# EAGLE design ads1292_Dorokhov (EAGLE 7.1.0)
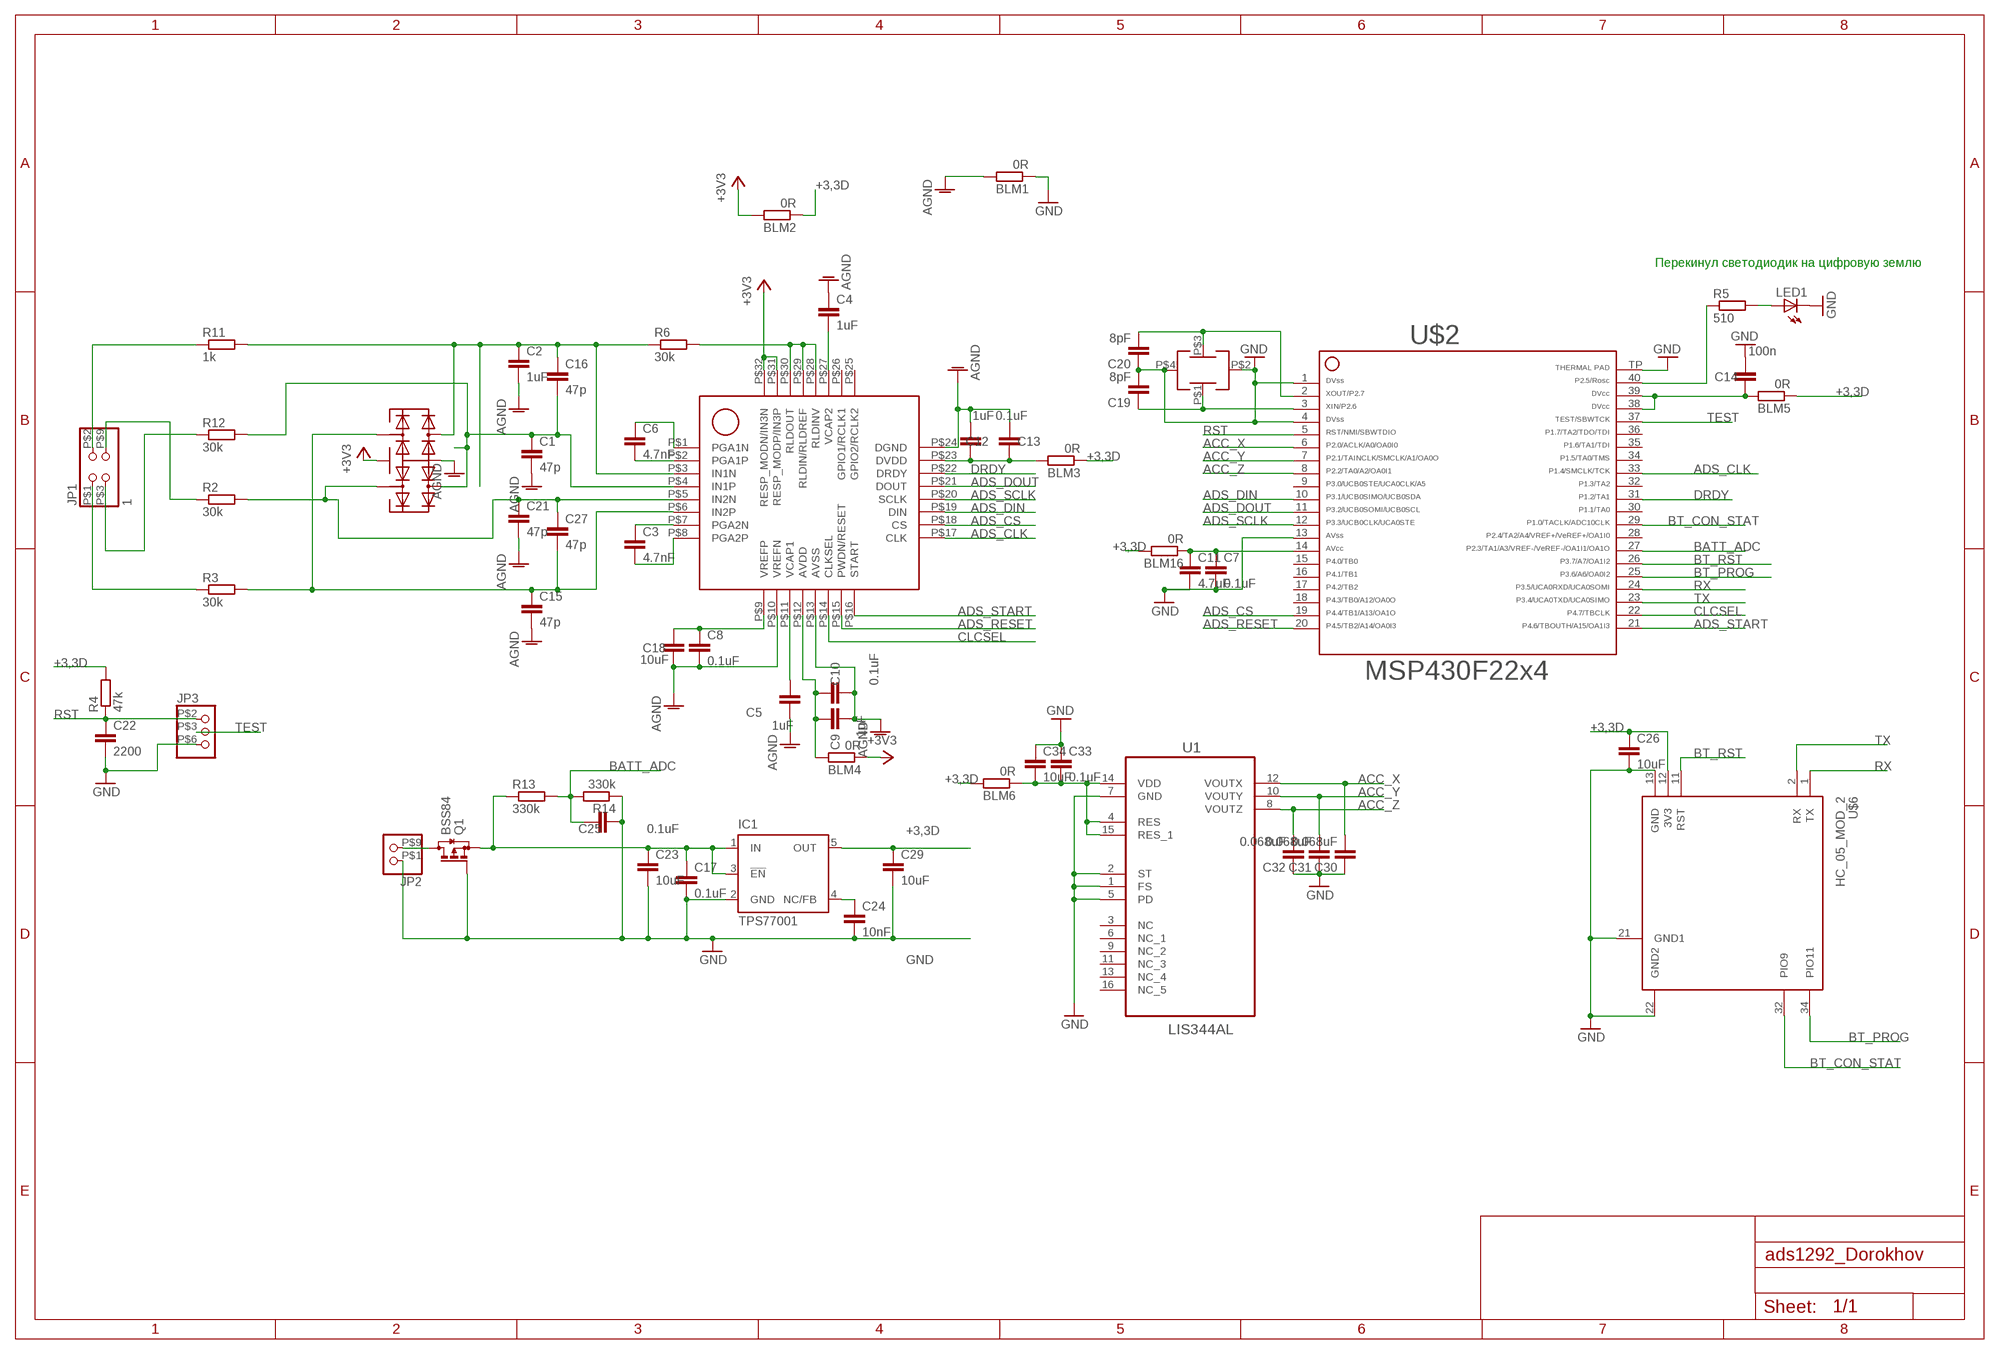
[diagram p0: schematic, sheet 1]

## Parts
BLM1  0R  RES0402  [SMD_0402]
BLM2  0R  RES0402  [SMD_0402]
BLM3  0R  RES0402  [SMD_0402]
BLM4  0R  RES0402  [SMD_0402]
BLM5  0R  RES0402  [SMD_0402]
BLM6  0R  RES0402  [SMD_0402]
BLM16  0R  RES0402  [SMD_0402]
C1  47p  CAP0402  [SMD_0402]
C2  1uF  CAP0603  [SMD_0603]
C3  4.7nF  CAP0402  [SMD_0402]
C4  1uF  CAP0402  [SMD_0402]
C5  1uF  CAP0402  [SMD_0402]
C6  4.7nF  CAP0402  [SMD_0402]
C7  0.1uF  CAP0402  [SMD_0402]
C8  0.1uF  CAP0402  [SMD_0402]
C9  1uF  CAP0402  [SMD_0402]
C10  0.1uF  CAP0402  [SMD_0402]
C11  4.7uF  CAP0603  [SMD_0603]
C12  1uF  CAP0402  [SMD_0402]
C13  0.1uF  CAP0402  [SMD_0402]
C14  100n  CAP0402  [SMD_0402]
C15  47p  CAP0402  [SMD_0402]
C16  47p  CAP0402  [SMD_0402]
C17  0.1uF  CAP0402  [SMD_0402]
C18  10uF  CAP0603  [SMD_0603]
C19  8pF  CAP0402  [SMD_0402]
C20  8pF  CAP0402  [SMD_0402]
C21  47p  CAP0402  [SMD_0402]
C22  2200  CAP0402  [SMD_0402]
C23  10uF  CAP0603  [SMD_0603]
C24  10nF  CAP0402  [SMD_0402]
C25  0.1uF  CAP0402  [SMD_0402]
C26  10uF  CAP0603  [SMD_0603]
C27  47p  CAP0402  [SMD_0402]
C29  10uF  CAP0603  [SMD_0603]
C30  0.068uF  CAP0402  [SMD_0402]
C31  0.068uF  CAP0402  [SMD_0402]
C32  0.068uF  CAP0402  [SMD_0402]
C33  0.1uF  CAP0402  [SMD_0402]
C34  10uF  CAP0603  [SMD_0603]
IC1  TPS77001  [SOT23-DBV]
JP1  1  PINHD-2X2SMD_2,5  [PINHEAD_SMD_2X2_2,5]
JP2  PINHD-1X2SMD_2,5  [PINHEAD_SMD_2X1_2,5]
JP3  PINHD-1X3PROG_SMD  [PROG_CONNECTOR_3PIN]
LED1  LEDSML0603  [SML0603]
Q1  BSS84  [SOT23]
R2  30k  RESR0603_WIDE  [R0603]
R3  30k  RESR0603_WIDE  [R0603]
R4  47k  RES0402  [SMD_0402]
R5  510  RES0402  [SMD_0402]
R6  30k  RES0402  [SMD_0402]
R11  1k  RESR0603_WIDE  [R0603]
R12  30k  RESR0603_WIDE  [R0603]
R13  330k  RES0402  [SMD_0402]
R14  330k  RES0402  [SMD_0402]
U1  LIS344AL  [LGA16R65P4X4_400X400X160]
U$1  ADS1292TQFP-32  [TQFP-32]
U$2  F22X4---RHA40  [RHA40]
U$3  ECS_16_CRYSTAL  [ECS_16_CRYSTAL]
U$4  DALC208  [SOT23-6]
U$6  HC_05_MOD_2  [BLUETOOTH_SMD_MOD2]

## Nets
+3,3D: BLM2.P$3 BLM3.P$3 BLM5.P$3 BLM6.P$4 BLM16.P$4 C26.P$1 C29.P$1 IC1.5(OUT) R4.P$4 U$6.12(3V3)
+3V3: BLM2.P$4 BLM4.P$3 U$1.P$31(RESP_MODP/IN3P) U$1.P$32(RESP_MODN/IN3N) U$4.2
ACC_X: C30.P$4 U1.12(VOUTX) U$2.6
ACC_Y: C31.P$4 U1.10(VOUTY) U$2.7
ACC_Z: C32.P$4 U1.8(VOUTZ) U$2.8
ADS_CLK: U$1.P$17(CLK) U$2.33
ADS_CS: U$1.P$18(CS) U$2.19
ADS_DIN: U$1.P$19(DIN) U$2.10
ADS_DOUT: U$1.P$21(DOUT) U$2.11
ADS_RESET: U$1.P$15(PWDN/RESET) U$2.20
ADS_SCLK: U$1.P$20(SCLK) U$2.12
ADS_START: U$1.P$16(START) U$2.21
AGND: BLM1.P$4 C1.P$4 C2.P$2 C4.P$3 C5.P$4 C8.P$4 C9.P$4 C10.P$4 C12.P$4 C13.P$4 C15.P$4 C18.P$2 C21.P$4 U$1.P$10(VREFN) U$1.P$13(AVSS) U$1.P$24(DGND) U$4.5
BATT_ADC: C25.P$3 R13.P$4 R14.P$4 U$2.27
BT_CON_STAT: U$2.29 U$6.32(PIO9)
BT_PROG: U$2.25 U$6.34(PIO11)
BT_RST: U$2.26 U$6.11(RST)
CLCSEL: U$1.P$14(CLKSEL) U$2.22
DRDY: U$1.P$22(DRDY) U$2.31
GND: BLM1.P$3 C7.P$4 C11.P$2 C14.P$4 C17.P$4 C19.P$4 C20.P$3 C22.P$4 C23.P$2 C24.P$4 C25.P$4 C26.P$2 C29.P$2 C30.P$3 C31.P$3 C32.P$3 C33.P$3 C34.P$1 IC1.2(GND) JP2.P$1 JP3.P$6 LED1.C Q1.1(G) R14.P$3 U1.1(FS) U1.2(ST) U1.5(PD) U1.7(GND) U$2.1 U$2.4 U$2.13 U$2.TP U$3.P$2 U$3.P$4 U$6.13(GND) U$6.21(GND1) U$6.22(GND2)
N$1: BLM3.P$4 C12.P$3 C13.P$3 U$1.P$23(DVDD)
N$2: BLM16.P$3 C7.P$3 C11.P$1 U$2.14
N$3: BLM4.P$4 C9.P$3 C10.P$3 U$1.P$12(AVDD)
N$4: C21.P$3 C27.P$3 R2.2 U$1.P$5(IN2N) U$4.3
N$5: C3.P$3 U$1.P$7(PGA2N)
N$6: C3.P$4 U$1.P$8(PGA2P)
N$7: C5.P$3 U$1.P$11(VCAP1)
N$8: C4.P$4 U$1.P$27(VCAP2)
N$9: C6.P$4 U$1.P$2(PGA1P)
N$10: C6.P$3 U$1.P$1(PGA1N)
N$11: C8.P$3 C18.P$1 U$1.P$9(VREFP)
N$12: BLM5.P$4 C14.P$3 U$2.38 U$2.39
N$13: R5.P$3 U$2.40
N$14: C15.P$3 C27.P$4 R3.2 U$1.P$6(IN2P) U$4.1
N$15: C1.P$3 C16.P$4 R12.2 U$1.P$4(IN1P) U$4.6
N$16: C19.P$3 U$2.3 U$3.P$1
N$17: BLM6.P$3 C33.P$4 C34.P$2 U1.4(RES) U1.14(VDD) U1.15(RES_1)
N$19: LED1.A R5.P$4
N$20: JP1.P$1 R3.1
N$21: JP1.P$9 R2.1
N$22: JP1.P$3 R12.1
N$23: C2.P$1 C16.P$3 R6.P$3 R11.2 U$1.P$3(IN1N) U$4.4
N$24: JP1.P$2 R11.1
N$25: C20.P$4 U$2.2 U$3.P$3
N$26: JP2.P$9 Q1.3(D)
N$27: R6.P$4 U$1.P$28(RLDINV) U$1.P$29(RLDIN/RLDREF) U$1.P$30(RLDOUT)
N$30: C24.P$3 IC1.4(NC/FB)
RST: C22.P$3 JP3.P$2 R4.P$3 U$2.5
RX: U$2.24 U$6.1(TX)
TEST: JP3.P$3 U$2.37
TX: U$2.23 U$6.2(RX)
VLOAD: C17.P$3 C23.P$1 IC1.1(IN) IC1.3(!EN) Q1.2(S) R13.P$3
Unconnected: U1.3(NC) U1.6(NC_1) U1.9(NC_2) U1.11(NC_3) U1.13(NC_4) U1.16(NC_5) U$1.P$25(GPIO2/RCLK2) U$1.P$26(GPIO1/RCLK1) U$2.9 U$2.15 U$2.16 U$2.17 U$2.18 U$2.28 U$2.30 U$2.32 U$2.34 U$2.35 U$2.36

## Notes on the sheet
- Перекинул светодиодик на цифровую землю

## Library data of the parts
BLM1-BLM6 BLM16 R2-R6 R11-R14 = ads1292_Dorokhov:RES
C1-C27 C29-C34 = ads1292_Dorokhov:CAP: Capacitor Standard 0603 ceramic capacitor, and 0.1" leaded capacitor.
IC1 = texas:TPS770*: ULTRALOW-POWER 50-mA LOW-DROPOUT LINEAR REGULATORS 50-mA Low-Dropout Regulator Source: http://focus.ti.com/lit/ds/symlink/tps77001.pdf; MF: TEXAS INSTRUMENTS; MPN: TPS77001DBVT; OC_FARNELL: 8461554; OC_NEWARK: 77C1171
JP1 = ads1292_Dorokhov:PINHD-2X2: PIN HEADER
JP2 = ads1292_Dorokhov:PINHD-1X2: PIN HEADER
JP3 = ads1292_Dorokhov:PINHD-1X3: PIN HEADER
LED1 = led:LED: LED OSRAM: - CHIPLED LG R971, LG N971, LY N971, LG Q971, LY Q971, LO R971, LY R971 LH N974, LH R974 LS Q976, LO Q976, LY Q976 LO Q996 - Hyper CHIPLED LW Q18S LB Q993, LB Q99A, LB R99A - SideLED LS A670, LO A670, LY A670, LG A670, LP A670 LB A673, LV A673, LT A673, LW A673 LH A674 LY A675 LS A676, LA A676, LO A676, LY A676, LW A676 LS A679, LY A679, LG A679 - Hyper Micro SIDELED® LS Y876, LA Y876, LO Y876, LY Y876 LT Y87S - SmartLED LW L88C, LW L88S LB L89C, LB L89S, LG L890 LS L89K, LO L89K, LY L89K LS L896, LA L896, LO L896, LY L896 - TOPLED LS T670, LO T670, LY T670, LG T670, LP T670 LSG T670, LSP T670, LSY T670, LOP T670, LYG T670 LG T671, LOG T671, LSG T671 LB T673, LV T673, LT T673, LW T673 LH T674 LS T676, LA T676, LO T676, LY T676, LB T676, LH T676, LSB T676, LW T676 LB T67C, LV T67C, LT T67C, LS T67K, LO T67K, LY T67K, LW E67C LS E67B, LA E67B, LO E67B, LY E67B, LB E67C, LV E67C, LT E67C LW T67C LS T679, LY T679, LG T679 LS T770, LO T770, LY T770, LG T770, LP T770 LB T773, LV T773, LT T773, LW T773 LH T774 LS E675, LA E675, LY E675, LS T675 LS T776, LA T776, LO T776, LY T776, LB T776 LHGB T686 LT T68C, LB T68C - Hyper Mini TOPLED® LB M676 - Mini TOPLED Santana® LG M470 LS M47K, LO M47K, LY M47K Source: http://www.osram.convergy.de LUXEON: - LUMILED® LXK2-PW12-R00, LXK2-PW12-S00, LXK2-PW14-U00, LXK2-PW14-V00 LXK2-PM12-R00, LXK2-PM12-S00, LXK2-PM14-U00 LXK2-PE12-Q00, LXK2-PE12-R00, LXK2-PE12-S00, LXK2-PE14-T00, LXK2-PE14-U00 LXK2-PB12-K00, LXK2-PB12-L00, LXK2-PB12-M00, LXK2-PB14-N00, LXK2-PB14-P00, LXK2-PB14-Q00 LXK2-PR12-L00, LXK2-PR12-M00, LXK2-PR14-Q00, LXK2-PR14-R00 LXK2-PD12-Q00, LXK2-PD12-R00, LXK2-PD12-S00 LXK2-PH12-R00, LXK2-PH12-S00 LXK2-PL12-P00, LXK2-PL12-Q00, LXK2-PL12-R00 Source: www.luxeon.com KINGBRIGHT: KA-3528ASYC Source: www.kingbright.com
Q1 = transistor-small-signal:BSS84: P-CHANNEL MOS FET
U1 = ads1292_Dorokhov:LIS344AL: MEMS inertial sensor; MPN: LIS344AL; OC_FARNELL: 1838529; OC_NEWARK: 56P7991; PACKAGE: LGA-16; SUPPLIER: STMicroelectronics
U$1 = ads1292_Dorokhov:ADS1292
U$2 = TI_MSP430_v16:F22X4---RHA40: ***MSP430F22x4***RHA40
U$3 = alvw:ECS_16_CRYSTAL
U$4 = ads1292_Dorokhov:DALC208
U$6 = ads1292_Dorokhov:HC_05_MOD_2

## Board
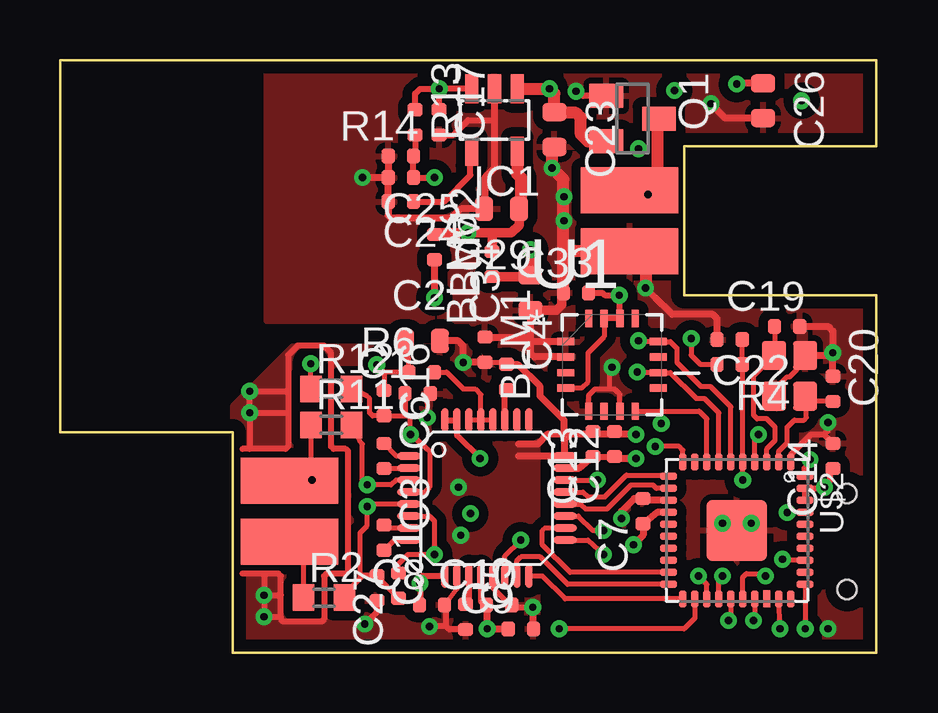
[diagram p1: board, top side]
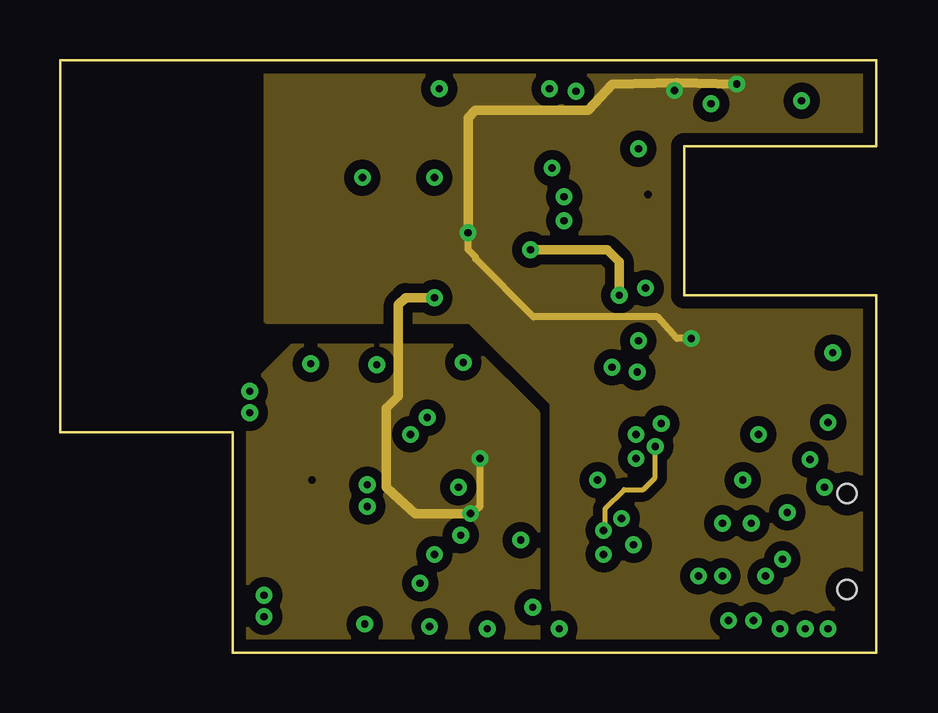
[diagram p2: board, inner layer POWER]
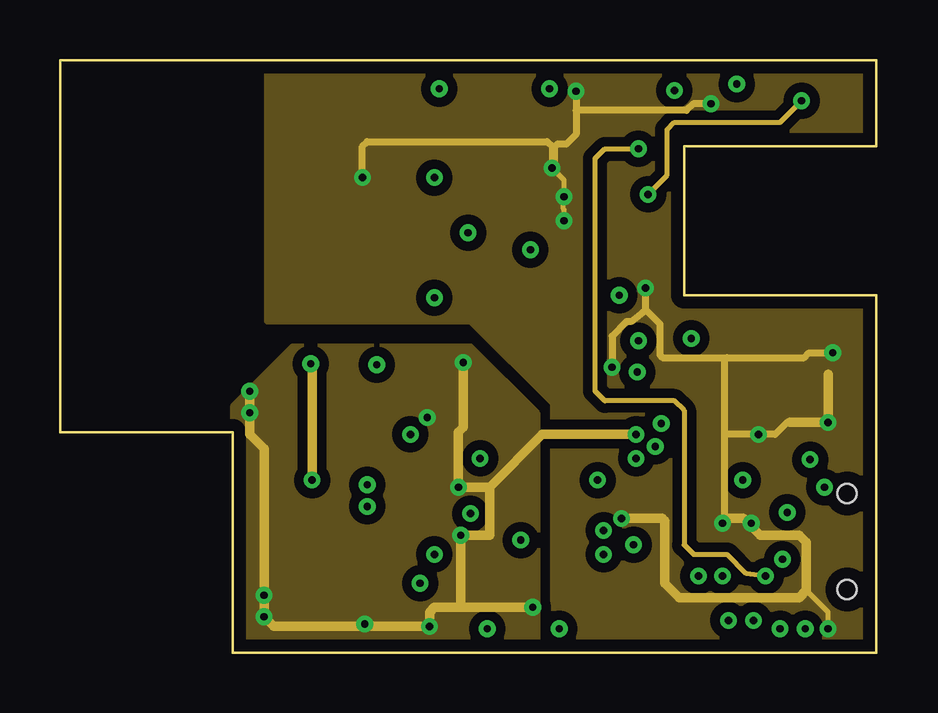
[diagram p3: board, inner layer GND]
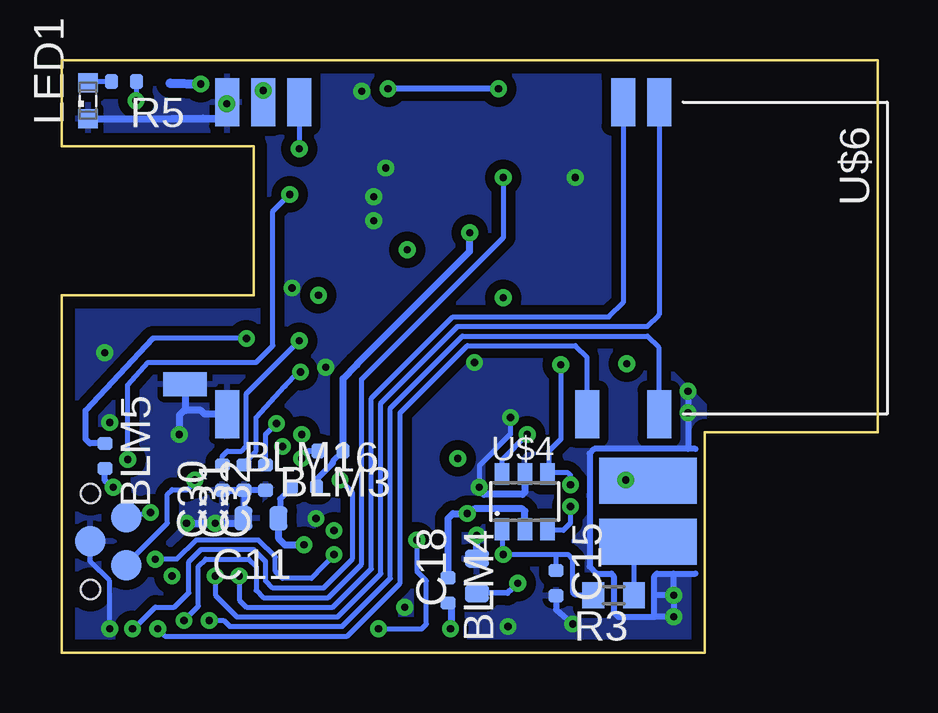
[diagram p4: board, bottom side, seen from below]

Size 34 x 24.7 mm. Coordinates in mm from the lower left corner, seen from the top.
Outline: 7.2,0 34,0 34,14.9 26,14.9 26,21.1 34,21.1 34,24.7 0,24.7 0,9.2 7.2,9.2 7.2,0
Copper layers ((1*2)+(15*16)): Top 0.018mm / dielectric 0.5mm / POWER 0.018mm / dielectric 0.5mm / GND 0.018mm / dielectric 0.5mm / Bottom 0.018mm
Design rules "default *": minimum track width 0.15mm, minimum drill 0.3mm, track to track 0.2mm, track to pad 0.2mm, pad to pad 0.2mm, via to via 0.2mm, smd to smd 0mil, copper to edge 0.5mm, drill to drill 8mil, minimum pad ring 10mil, minimum via ring 0.2mm, stop-mask expansion 4mil, vias tented up to drill 0mil, thermal gap 10mil

### Footprints (pad centres in the part's own frame; a part is rotated, then mirrored left to right if it is on the bottom)
SMD_0402 = smd 0.55 x 0.625: P$3 -0.525,0; P$4 0.525,0
SMD_0603 = smd 0.75 x 1: P$1 -0.725,0; P$2 0.725,0
SOT23-DBV = smd 0.55 x 1.2: 1 -0.95,-1.3; 2 0,-1.3; 3 0.95,-1.3; 4 0.95,1.3; 5 -0.95,1.3
PINHEAD_SMD_2X2_2,5 = smd 4.064 x 1.905 bottom: P$1 1.27,-1.27; P$3 1.27,1.27 | smd 4.064 x 1.905: P$2 1.27,1.27; P$9 1.27,-1.27
PINHEAD_SMD_2X1_2,5 = smd 4.064 x 1.905: P$1 1.27,1.27; P$9 1.27,-1.27
PROG_CONNECTOR_3PIN = smd 1.27 x 1.27: P$2 -1,-0.5; P$3 1,-0.5; P$6 0,1 | hole 0.8: -2,1; 2,1
SML0603 = smd 0.8 x 0.8: A 0.75,0; C -0.75,0
SOT23 = smd 1 x 1.4: 1 -0.95,-1.1; 2 0.95,-1.1; 3 0,1.1
R0603 = smd 0.9 x 1.1: 1 -0.85,0; 2 0.85,0
LGA16R65P4X4_400X400X160 = smd 0.711 x 0.305: 1 -1.93,0.965; 2 -1.93,0.33; 3 -1.93,-0.33; 4 -1.93,-0.965; 9 1.93,-0.965; 10 1.93,-0.33; 11 1.93,0.33; 12 1.93,0.965 | smd 0.305 x 0.711: 5 -0.965,-1.93; 6 -0.33,-1.93; 7 0.33,-1.93; 8 0.965,-1.93; 13 0.965,1.93; 14 0.33,1.93; 15 -0.33,1.93; 16 -0.965,1.93
TQFP-32 = smd 1 x 0.29: P$1 -3.16,2.5; P$2 -3.16,2; P$3 -3.16,1.5; P$4 -3.16,1; P$5 -3.16,0.5; P$6 -3.16,0; P$7 -3.16,-0.5; P$8 -3.16,-1; P$17 3.34,-1; P$18 3.34,-0.5; P$19 3.34,0; P$20 3.34,0.5; P$21 3.34,1; P$22 3.34,1.5; P$23 3.34,2; P$24 3.34,2.5 | smd 0.29 x 1: P$9 -1.66,-2.5; P$10 -1.16,-2.5; P$11 -0.66,-2.5; P$12 -0.16,-2.5; P$13 0.34,-2.5; P$14 0.84,-2.5; P$15 1.34,-2.5; P$16 1.84,-2.5; P$25 1.84,4; P$26 1.34,4; P$27 0.84,4; P$28 0.34,4; P$29 -0.16,4; P$30 -0.66,4; P$31 -1.16,4; P$32 -1.66,4
RHA40 = smd 0.7 x 0.3: 1 -2.85,2.25; 2 -2.85,1.75; 3 -2.85,1.25; 4 -2.85,0.75; 5 -2.85,0.25; 6 -2.85,-0.25; 7 -2.85,-0.75; 8 -2.85,-1.25; 9 -2.85,-1.75; 10 -2.85,-2.25; 21 2.85,-2.25; 22 2.85,-1.75; 23 2.85,-1.25; 24 2.85,-0.75; 25 2.85,-0.25; 26 2.85,0.25; 27 2.85,0.75; 28 2.85,1.25; 29 2.85,1.75; 30 2.85,2.25 | smd 0.3 x 0.7: 11 -2.25,-2.85; 12 -1.75,-2.85; 13 -1.25,-2.85; 14 -0.75,-2.85; 15 -0.25,-2.85; 16 0.25,-2.85; 17 0.75,-2.85; 18 1.25,-2.85; 19 1.75,-2.85; 20 2.25,-2.85; 31 2.25,2.85; 32 1.75,2.85; 33 1.25,2.85; 34 0.75,2.85; 35 0.25,2.85; 36 -0.25,2.85; 37 -0.75,2.85; 38 -1.25,2.85; 39 -1.75,2.85; 40 -2.25,2.85 | smd 2.54 x 2.54: TP 0,0
ECS_16_CRYSTAL = smd 1.2 x 1: P$1 -0.85,-0.65; P$2 -0.85,0.65; P$3 0.85,0.65; P$4 0.85,-0.65
SOT23-6 = smd 0.6 x 0.9: 1 -0.95,-1.15; 2 0,-1.15; 3 0.95,-1.15; 4 0.95,1.15; 5 0,1.15; 6 -0.95,1.15
BLUETOOTH_SMD_MOD2 = smd 2 x 1: 1 -6.35,6.35; 2 -6.35,4.85; 11 -6.35,-8.65; 12 -6.35,-10.15; 13 -6.35,-11.65; 22 6.65,-11.65; 32 6.65,3.35; 34 6.65,6.35 | smd 1 x 1.8: 21 5.4,-13.4

### Placement (x,y rotation side)
BLM1  17.7,12.63 270 top
BLM2  15.6,16.9 270 top
BLM3  22.8,8.4 180 bottom
BLM4  17.9,2.6 270 bottom
BLM5  32.2,8.2 270 bottom
BLM6  18,16.2 90 top
BLM16  23.9,6.9 0 bottom
C1  14.9,10.8 0 top
C2  15.1,13 0 top
C3  13.5,4.8 270 top
C4  18.6,11.5 270 top
C5  16.9,1.5 270 top
C6  13.5,8.2 270 top
C7  24.3,5.9 90 top
C8  15.5,2 0 top
C9  19.2,1 0 top
C10  18.3,2 0 top
C11  25.7,5.6 180 bottom
C12  23.1,8.7 90 top
C13  22.2,8.7 90 top
C14  32.2,8.2 90 top
C15  13.4,2.9 270 bottom
C16  13.5,10.4 270 top
C17  15.8,22.1 270 top
C18  16.7,3.2 90 bottom
C19  30.3,13.6 0 top
C20  32.2,11 270 top
C21  13.2,2.7 270 top
C22  27.9,13.05 180 top
C23  20.6,21.8 270 top
C24  14.2,18.8 180 top
C25  14.2,19.8 180 top
C26  29.3,23 270 top
C27  14.1,2.8 90 top
C29  18.4,18.5 180 top
C30  27.3,7.3 90 bottom
C31  26.4,7.3 90 bottom
C32  25.5,7.3 90 bottom
C33  21.5,15 0 top
C34  19.6,15 90 top
IC1  18.1,22.2 180 top
JP1  8.3,5.9 0 top
JP2  25,18 180 top
JP3  31.8,4.64 90 bottom
LED1  32.9,23 90 bottom
Q1  23.86,22.26 270 top
R2  11,2.3 0 top
R3  11,2.4 180 bottom
R4  27.9,12.01 180 top
R5  31.4,23.8 180 bottom
R6  15.07,11.69 0 top
R11  11.3,9.5 0 top
R12  11.3,11 0 top
R13  14.8,22.1 270 top
R14  14.2,20.7 0 top
U1  23,12 0 top
U$1  17.7,5.7 0 top
U$2  28.2,5.1 270 top
U$3  30.4,11.54 270 top
U$4  14.7,6.3 0 bottom
U$6  15.46,16.59 270 bottom

### Tracks (layer width: path | path; a pad name or v marks a point on that pad's centre or on a via)
+3,3D  (via drill 0.3)
  Top 0.2: R4.P$4 26.69,12.01 26.3,12.4 v26.3,13.1
  Top 0.3: 29.23,23.7 C26.P$1 | 29.48,23.72 28.23,23.72 v28.2,23.7 | BLM2.P$3 15.68,17.43 15.7,17.5
  Top 0.4: C29.P$1 19.12,17.82 18.8,17.5 18,17.5 | 18,17.5 v17,17.5 15.7,17.5 | BLM6.P$4 18,17.5 | C26.P$1 29.48,23.72
  Top 0.5: IC1.5 19.05,19.95 19.2,19.8 19.2,18.97 C29.P$1
  POWER 0.3: v26.3,13.1 25.7,13.1 24.9,14 19.73,14 17.31,16.41 17.31,16.49 17,16.8 v17,17.5
  POWER 0.4: v28.2,23.7 25.71,23.75 23,23.7 22,22.6 17.3,22.6 17,22.3 v17,17.5
  POWER 0.406: v25.6,23.43 25.71,23.33 25.71,23.75
  Bottom 0.2: v26.3,13.1 30.2,13.1 | BLM16.P$4 23.38,6.92
  Bottom 0.25: v25.6,23.43 U$6.12 | BLM5.P$3 32.83,8.72 33,8.9 33,10.1 30.2,13.1 | 23.38,6.92 23.38,7.23 22.7,7.9 22.7,7.98 BLM3.P$3 | 29.4,23.7 v28.2,23.7
  Bottom 0.3: v17,17.5 17,16.73 21.7,12.02 21.7,12 22.27,11.42 BLM3.P$3
  Bottom 0.4: 29.48,23.72 v28.2,23.7
  pour POWER (isolate 0.4): 8.6,13.8 8.6,24.7 34,24.7 34,21.1 26,21.1 26,14.9 34,14.9 34,0 20.5,0 20.5,10.4 17.1,13.8
+3V3  (via drill 0.3)
  Top 0.25: U$1.P$32 U$1.P$31 16.54,9.06 v17.5,8.1
  Top 0.3: BLM2.P$4 v15.6,14.8
  POWER 0.3: v17.1,5.8 17.5,6.1 v17.5,8.1
  POWER 0.4: v17.1,5.8 14.8,5.8 13.9,6.6 13.6,6.9 13.6,10.2 14.1,10.7 14.1,14.5 14.4,14.8 v15.6,14.8
  Bottom 0.3: U$4.2 14.7,5.9 14.8,6 16.8,6 v17.1,5.8 | 17.1,5.7 v17.1,5.8 | BLM4.P$3 17.9,5.6 17.7,5.8 v17.1,5.8
  pour POWER (isolate 0.4): 7.2,0 7.2,10.3 9.7,12.8 17.1,12.8 19.9,10 19.9,0
ACC_X  (via drill 0.3)
  Top 0.2: U$2.6 27.95,10.25 27.1,11.1 26.7,11.1 25.7,12.1 25.7,12.7 25.43,12.96 U1.12 24.14,12.96 v24.1,13
  Bottom 0.2: C30.P$4 27.3,8.2 27.1,8.4 26.5,8.4 26.3,8.6 26.3,10.8 v24.1,13
ACC_Y  (via drill 0.3)
  Top 0.2: U$2.7 27.45,10 26.85,10.6 26.5,10.6 25.43,11.67 U1.10 24.08,11.67 v24.05,11.7
  Bottom 0.2: C31.P$4 26.4,7.9 25.9,8.4 25.9,9.8 24.7,11.1 24.15,11.7 v24.05,11.7
ACC_Z  (via drill 0.3)
  Top 0.2: U$2.8 26.95,9.75 26.63,10.07 25,10.07 | 24.96,9.36 v25.05,9.55 25.05,10.02 25,10.07 | U1.8 25,10.07
  Bottom 0.2: v25.05,9.55 25.5,9.1 C32.P$4
ADS_CLK  (via drill 0.3)
  Top 0.2: U$1.P$17 22,4.7 v22.65,4.1 | U$2.33 30.15,3.85 v30.1,3.9
  Bottom 0.2: v30.1,3.9 29.2,3.9 28.4,4.7 25.8,4.7 25.1,4 25.1,3.4 24.8,3.1 23.6,3.1 v22.65,4.1
ADS_CS
  Top 0.2: U$2.19 21.25,3.35 20.1,4.5 20.1,5.1 20.2,5.2 U$1.P$18
ADS_DIN  (via drill 0.3)
  Top 0.2: U$1.P$19 21.6,5.7 22.2,5.1 v22.65,5.1 | U$2.10 25.95,8.45 25.8,8.6 v24.8,8.6
  POWER 0.2: v24.8,8.6 24.8,7.3 24.3,6.8 23.5,6.8 22.7,6 22.7,5.15 v22.65,5.1
ADS_DOUT
  Top 0.2: U$2.11 25.25,7.35 25.1,7.4 23.6,7.4 22.7,6.5 22,6.5 21.8,6.7 U$1.P$21
ADS_RESET
  Top 0.2: U$2.20 21.15,2.85 20,4 19.2,4 19.04,3.84 U$1.P$15 19.04,3.26 19,3.3
ADS_SCLK
  Top 0.2: U$2.12 24.85,6.85 24.7,7 23.8,7 22.8,6 21.9,6 21.7,6.2 U$1.P$20
ADS_START
  Top 0.2: U$2.21 21.05,2.25 20.1,3.2 U$1.P$16
AGND  (via drill 0.3)
  Top 0.2: 12.8,1.2 v12.7,1.2 | 18.7,2.05 18.04,2.71 U$1.P$13 | v16.8,12.1 17.09,12.1 BLM1.P$4 18.42,12.1 C4.P$3 | 16,2 C8.P$4 16.54,2.67 U$1.P$10 | 23.9,9.1 23.23,9.1 C12.P$4 | C21.P$4 13.07,2.17 | C1.P$4 15.32,10.72 15.3,10.4 v15.3,9.8 | 16.6,6.8 v16.6,6.9 | U$1.P$24 21,8.2
  Top 0.25: C5.P$4 16.23,0.97 16.1,1.1 | 16.1,1.1 16.1,1.92 | 16.1,1.92 C8.P$4 | C10.P$4 18.73,2.1 18.7,2.05 18.8,1.9 v19.7,1.9 | 16.1,2.1 16.1,1.92 | 16.1,1.1 v15.4,1.1 | 9.5,10.9 9.5,12.4 9.9,12.8 11,12.8 11.3,12.5 11.3,8.6 11.4,8.5 11.9,8.5 12,8.4 12,3.4 11.9,3.3 11.1,3.3 11,3.2 11,1.4 10.9,1.3 9.3,1.3 9.2,1.4 9.2,1.5 | 9.5,10.9 9.5,10 | 9.5,10 9.5,8.6 9.4,8.5 7.9,8.5 | 7.9,8.5 7.6,8.5 | 9.2,1.5 9.2,2.4 | 9.2,2.4 9.2,3.2 9.1,3.3 8.5,3.3 | 8.5,3.3 7.6,3.3 | 9.5,10.9 v7.9,10.9 v7.9,10 | v7.9,10 9.5,10 | v7.9,10 7.9,8.5 | 8.5,3.3 v8.5,2.4 | 9.2,1.5 v8.5,1.5 v8.5,2.4 | v8.5,2.4 9.2,2.4 | C21.P$4 13.2,1.7 v12.7,1.2
  Top 0.3: C9.P$4 19.73,1.77 v19.7,1.9 | BLM1.P$4 v16.8,12.1 | 16.6,12.1 v16.8,12.1 | 24.02,9.12 v24,9.1 23.9,9.1 22.32,9.1 | 22.32,9.1 C13.P$4 | 22.32,9.1 21.2,9.1 | 21.2,9.1 21,8.9 | 21,8.9 21,8.24 U$1.P$24 | v16.8,12.1 16.8,12.8 16.6,13 C2.P$2 | 21,8.9 21,9.7 20,10.7 20,11.1 19.1,12 18.6,12 | 21.2,9.1 20.3,9.1 19.9,8.7 19.1,8.7 | 21,8.2 19.1,8.2
  GND 0.25: v12.7,1.2 12.6,1.1
  GND 0.4: 17.9,6.9 17.9,4.9 v16.7,4.9 16.7,1.9 | 17.9,6.9 v16.6,6.9 16.6,9.2 16.8,9.4 v16.8,12.1 | v19.7,1.9 16.7,1.9 | 16.7,1.9 15.6,1.9 15.4,1.7 v15.4,1.1 12.6,1.1 8.9,1.1 v8.5,1.5 v8.5,2.4 8.5,8.5 7.9,9.1 v7.9,10.9 | v24,9.1 20.1,9.1 17.9,6.9
  Bottom 0.2: v15.3,9.8 15.3,9.1 16.6,7.8 v16.6,6.9
  Bottom 0.25: 7.6,8.5 7.9,8.5 | 7.9,8.5 11.8,8.5 12,8.3 12,3.6 11.7,3.3 11.1,3.3 11,3.2 11,1.7 10.8,1.5 9.3,1.5 | 9.3,1.5 9.3,2.4 | 9.3,2.4 9.3,3.2 9.2,3.3 8.5,3.3 | 8.5,3.3 7.6,3.3 | v8.5,2.4 8.5,3.3 | v8.5,2.4 v8.5,1.5 9.3,1.5 | v8.5,2.4 9.3,2.4 | v7.9,10.9 7.9,8.5 | C15.P$4 13.4,1.8 12.8,1.3 v12.7,1.2
  Bottom 0.3: U$4.5 14.7,6.7 14.8,6.6 16.4,6.6 v16.6,6.9 | C18.P$2 v16.7,4.9
  pour Bottom (isolate 0.4): 7.2,0 7.2,10.3 9.7,12.8 17.1,12.8 19.9,10 19.9,0
  pour GND (isolate 0.4): 7.2,0 7.2,10.3 9.7,12.8 17.1,12.8 19.9,10 19.9,0
  pour Top (isolate 0.4): 7.2,0 7.2,10.3 9.7,12.8 17.1,12.8 19.9,10 19.9,0
BATT_ADC  (via drill 0.3)
  Top 0.2: U$2.27 28.95,1.4 v28.9,1.35
  Top 0.25: v15.6,19.8 C25.P$3 R14.P$4 14.8,20.77 R13.P$4
  Bottom 0.2: v28.9,1.35 28.3,1.95 28.3,3.6 28,3.9 26.2,3.9 25.9,3.6 25.9,2.6 25.6,2.3 22.9,2.3 21.5,3.7 21.5,11.4 15.6,17.3 v15.6,19.8
BT_CON_STAT  (via drill 0.3)
  Top 0.2: v30,1 U$2.29
  Bottom 0.2: v30,1 29.7,0.7 22.1,0.7 19.9,2.9 19.9,10 17.1,12.8 12.6,12.8 12.11,12.31 U$6.32
BT_PROG  (via drill 0.3)
  Top 0.2: 27.9,1.5 v27.85,1.35 27.95,1.45 U$2.25
  Bottom 0.2: v27.85,1.35 27.25,1.35 27,1.1 22.3,1.1 20.3,3.1 20.3,10.2 17.3,13.2 9.6,13.2 9.11,12.71 U$6.34
BT_RST  (via drill 0.3)
  Top 0.2: U$2.26 28.45,3.15 28.6,3.3 29.3,3.3 v29.4,3.2
  GND 0.2: v29.4,3.2 28.6,3.3 27.8,4.1 26.4,4.1 26,4.5 26,10.1 25.6,10.5 22.7,10.5 22.3,10.9 22.3,20.6 22.7,21 v24.1,21
  Bottom 0.2: U$6.11 v24.11,21.01 v24.1,21
CLCSEL  (via drill 0.3)
  Top 0.2: U$1.P$14 18.54,4.04 v19.2,4.7 | U$2.22 26.45,1.45 26,1 v20.8,1
  Bottom 0.2: v20.8,1 19,1 18.8,1.2 18.8,3 19.2,3.4 v19.2,4.7
DRDY  (via drill 0.3)
  Top 0.2: U$1.P$22 v22.4,7.2 | U$2.31 v31.05,1
  Bottom 0.2: v22.4,7.2 21.9,6.7 21.9,3.9 23.1,2.7 25.2,2.7 25.5,3 25.5,3.8 26,4.3 28.2,4.3 28.7,3.8 28.7,2.5 29.3,1.9 30.1,1.9 31,1 v31.05,1
GND  (via drill 0.3)
  Top 0.2: U$2.4 28.95,9.05 v29.1,9.1 | U$3.P$4 29.75,10.95 30.3,11.5 30.4,11.5 30.7,11.8 30.7,12.04 U$3.P$2 | U1.5 22.04,10.73 22.3,11 22.9,11 | 22.9,11 23.1,11 23.33,10.77 U1.7 | 22.9,11 22.9,11.8 v23,11.9
  Top 0.25: 32.17,8.7 C14.P$4 31.82,9.1 | U$2.1 30.45,8.25 31.3,9.1 31.82,9.1 | Q1.1 21.81,23.21 v21.5,23.4 | v32,9.6 32,9.27 31.82,9.1 | 24.8,14.8 v24.4,15.2 | C17.P$4 16.38,21.57 17,22.2 18.1,22.2
  Top 0.3: U$2.13 24.48,6.35 C7.P$4 23.93,6.42 23.4,5.9 v23.4,5.6 | C19.P$4 32,13.6 32.2,13.4 v32.2,12.5 | C20.P$3 v32.2,12.5 | U$3.P$2 32.09,12.39 v32.2,12.5 | U1.2 19.77,12.33 19.6,12.5 19.6,12.9 | C34.P$1 19.6,13.1 | 19.6,13.1 19.6,12.9 | BLM1.P$3 19.55,13.15 19.6,13.1 | U1.1 19.66,12.96 19.6,12.9 | C24.P$4 C25.P$4 R14.P$3 | C24.P$4 13.68,19.68 13.7,19.7 13.7,19.8 v12.6,19.8 | C24.P$4 13.68,18.22 13.8,18.1 16.3,18.1 16.7,18.5 C29.P$2 17.7,18.93 17.7,19.8 18.1,20.2 18.1,22.2 IC1.2 | 29.43,22.25 C26.P$2 27.73,22.27 v27.13,22.88 | C22.P$4 27.38,13.92 27.2,14.1 25.5,14.1 24.8,14.8
  Top 0.4: v27.6,5.4 U$2.TP 28.5,4.8 | C34.P$1 20.68,14.27 20.9,14.5 20.9,14.92 C33.P$3
  Top 0.5: C33.P$3 20.98,16.7 | 20.98,16.7 20.98,19.72 v20.5,20.2 20.5,20.97 C23.P$2 | 20.98,16.7 21,16.73 JP2.P$1 24.93,16.73 25,16.8 24.5,16.8 24.4,16.7 v24.4,15.2
  GND 0.2: 23.1,11.9 v23,11.9 | v21,18 21,18.47 20.98,18.5 20.98,18.97 v21,19 21,19.7 v20.5,20.2 | v32,1 32,1.7 31.1,2.6
  GND 0.25: v20.5,20.2 20.5,20.8
  GND 0.3: 32.2,12.4 v32.2,12.5 | v12.6,19.8 12.6,21.1 12.8,21.3 20.3,21.3 20.5,21.1 v20.5,20.2 20.6,20.3 C23.P$2 20.73,21.2 21.1,21.2 21.5,21.6 21.5,22.6 | 24.4,14.3 24.3,14.2 23.8,13.8 23.6,13.8 23,13.2 v23,11.9 | 24.4,14.3 v24.4,15.2 | 27.8,12.3 25.1,12.3 25,12.4 25,13.7 24.4,14.3 | 27.8,12.3 31,12.3 31.2,12.5 v32.2,12.5 | 32.3,12.5 v32.2,12.5 | 27.7,5.6 27.7,9.1 | 27.7,9.1 27.7,12.2 27.8,12.3 | 30.5,9.6 30.3,9.6 29.8,9.1 v29.1,9.1 | 28.9,9.1 v29.1,9.1 | v29.1,9.1 27.7,9.1 | v21.5,23.4 21.5,22.6 | v27.13,22.88 26.38,22.88 26.1,22.6 21.5,22.6
  GND 0.4: 30.4,9.6 30.5,9.6 v32,9.6 32,11.6 | v23.4,5.6 25.1,5.6 25.2,5.5 25.2,2.9 25.8,2.3 30.8,2.3 31.1,2.6 31.1,4.6 30.8,4.9 29.18,4.9 28.48,5.6 27.7,5.6 v27.6,5.4
  Bottom 0.2: JP3.P$6 32.8,3.8 32,3 v32,1
  Bottom 0.25: 27.27,22.38 U$6.13 | C32.P$3 26.23,6.78 26.25,6.75 26.4,6.6 26.4,5.62 C11.P$2 | 28.12,22.27 29.4,22.27 29.43,22.25
  Bottom 0.3: 26.5,5.67 C11.P$2 26.62,5.4 v27.6,5.4 v28.8,5.4 | U$6.21 28.86,10.14 | 28.86,10.14 29.1,9.9 v29.1,9.1 | U$6.22 28.04,9.94 28.2,10.1 28.82,10.1 28.86,10.14 | LED1.C 29.43,22.25 27.25,22.25 27.2,22.2 27.2,22.8 v27.13,22.88 | C30.P$3 C31.P$3 26.27,6.78 26.25,6.75 | 28.12,22.27 27.38,22.27 27.27,22.38
  pour Bottom (isolate 0.4): 20.5,0 34,0 34,14.9 26,14.9 26,21.1 34,21.1 34,24.7 8.6,24.7 8.6,13.8 17.1,13.8 20.5,10.4
  pour GND (isolate 0.4): 20.5,0 34,0 34,14.9 26,14.9 26,21.1 34,21.1 34,24.7 8.6,24.7 8.6,13.8 17.1,13.8 20.5,10.4
  pour Top (isolate 0.4): 8.6,13.8 8.6,24.7 34,24.7 34,21.1 26,21.1 26,14.9 34,14.9 34,0 20.5,0 20.5,10.4 17.1,13.8
N$1  (via drill 0.3)
  Top 0.25: C13.P$3 C12.P$3
  Top 0.3: 23.88,8.17 v24,8.1 23,8.1 C12.P$3 | U$1.P$23 21.62,7.7 C13.P$3
  Bottom 0.25: 23.93,8.17 24.1,8.07 | BLM3.P$4 23.7,8.4 v24,8.1
  Bottom 0.3: 23.93,8.17 v24,8.1
N$2  (via drill 0.3)
  Top 0.3: U$2.14 24.88,5.85 C7.P$3 24.3,4.9 v23.9,4.5
  Bottom 0.25: BLM16.P$3 24.43,6.88 24.9,6.4 24.9,5.67 C11.P$1
  Bottom 0.3: v23.9,4.5 24.7,4.5 24.98,4.78 C11.P$1 25,5.62
N$3  (via drill 0.3)
  Top 0.25: U$1.P$12 17.54,2.13 C10.P$3
  Top 0.3: C9.P$3 v17.8,1 17.8,1.92 C10.P$3
  Bottom 0.3: BLM4.P$4 17.77,2.08 17.77,1.07 v17.8,1
N$4  (via drill 0.3)
  Top 0.2: v12.8,6.1 12.7,6 | U$1.P$5 12.9,6.2 v12.8,6.1 | R2.2 11.85,2.45 12.5,3.1 | 12.5,3.1 12.5,5 12.8,5.3 v12.8,6.1 | C27.P$3 C21.P$3 12.62,3.22 12.5,3.1
  Bottom 0.2: v12.8,6.1 12.8,5.4 13.1,5.1 13.7,5.1 U$4.3
N$5
  Top 0.2: U$1.P$7 13.62,5.2 C3.P$3
N$6
  Top 0.2: U$1.P$8 13.93,4.7 C3.P$4
N$7
  Top 0.25: U$1.P$11 17.04,2.26 C5.P$3
N$8
  Top 0.25: U$1.P$27 18.54,10.93 C4.P$4
N$9
  Top 0.2: C6.P$4 13.57,7.78 13.6,7.7 U$1.P$2
N$10
  Top 0.2: U$1.P$1 14.03,8.2 C6.P$3
N$11  (via drill 0.3)
  Top 0.25: U$1.P$9 15.1,3.2 15,3.1 v15,2.9 | v15,2.9 15,2.02 C8.P$3 14.97,1.92 | v15,2.9 15,2 14.9,2
  Bottom 0.25: v15,2.9 15.43,2.5 C18.P$1
N$12  (via drill 0.3)
  Top 0.25: U$2.38 U$2.39 31.65,6.85 v31.85,6.9 32.1,7.2 32.1,7.58 BLM5.P$4
  Bottom 0.25: v31.85,6.9 32.2,7.17 BLM5.P$4
N$13  (via drill 0.3, 0.3 layers 15-16)
  Top 0.2: U$2.40 31,7.3 31,7.7 v31.25,8.05
  GND 0.2: v24.5,19.1 25.3,19.9 25.3,21.8 25.6,22.1 30,22.1 v30.9,23
  Bottom 0.2: R5.P$3 30.9,23.8 v30.9,23 | v31.25,8.05 31.25,11.15 30.4,12.1 25.9,12.1 25.2,12.8 25.2,18.4 v24.5,19.1
N$14  (via drill 0.3)
  Top 0.2: U$1.P$6 15.4,5.7 15.6,5.5 v15.6,4.1 14.5,4.1 14.1,3.7 C27.P$4
  Bottom 0.2: 13.4,4.1 v15.6,4.1 15.65,4.15 U$4.1 | 13.4,4.1 12.9,4.1 12.7,3.9 12.7,2.5 12.6,2.4 R3.2 | C15.P$3 13.4,4.1
N$15  (via drill 0.3)
  Top 0.2: R12.2 12.8,10.7 12.9,10.6 12.9,10 13.03,9.88 C16.P$4 14.4,9.88 | 15.4,8.4 14.6,9.2 14.6,9.8 14.53,9.88 14.4,9.88 | 15.4,8.4 15.4,6.9 15.2,6.7 U$1.P$4 | v14.6,9.1 15.4,8.4 | C1.P$3 14.38,9.9 14.4,9.88
  Bottom 0.2: U$4.6 15.65,8.05 v14.6,9.1
N$16
  Top 0.2: U$2.3 29.45,8.5 29.8,8.85 29.8,9.4 29.45,9.75 29.05,9.75 28.9,9.9 28.9,11.54 U$3.P$1 29.77,12.41 C19.P$3
N$17  (via drill 0.3)
  Top 0.2: U1.4 21.73,11.04 22,11.3 22,12.5 22.67,13.17 U1.15
  Top 0.25: U1.15 U1.14 23.33,14.87 v23.3,14.9 22.7,14.9 22.6,15 C33.P$4
  Top 0.4: BLM6.P$3 19.55,15.67 C34.P$2 v19.6,16.8
  POWER 0.4: v19.6,16.8 22.8,16.8 23.3,16.3 v23.3,14.9
N$19
  Bottom 0.2: R5.P$4 32.85,23.8 LED1.A
N$20
  Bottom 0.2: R3.1 10.15,4.91 JP1.P$1
N$21
  Top 0.2: R2.1 10.15,4.91 JP1.P$9
N$22  (via drill 0.3, 0.3 layers 15-16)
  Top 0.2: R12.1 v10.45,12.05
  GND 0.25: 10.5,12 v10.45,12.05
  GND 0.4: v10.5,7.2 10.5,12
  Bottom 0.25: 10.6,7.7 10.39,7.49 10.15,7.49 JP1.P$3 10.47,7.17 v10.5,7.2
N$23  (via drill 0.3)
  Top 0.2: R11.2 12.5,8.8 12.6,8.7 12.6,7.1 12.7,7 v12.8,7 13.8,7 14,7.2 U$1.P$3 | 13.53,10.9 C16.P$3 13.5,11.7 v13.2,12 13.51,11.69 R6.P$3 14.5,11.73 14.5,12.3 14.38,12.42 C2.P$1
  Bottom 0.2: v12.8,7 12.8,7.4 12.9,7.5 13.7,7.5 13.7,8.4 13.2,8.9 v13.2,12
  Bottom 0.3: 13.7,7.5 U$4.4
N$24
  Top 0.2: R11.1 10.45,7.65 10.5,7.6 10,7.6 JP1.P$2
N$25
  Top 0.2: C20.P$4 31.27,10.47 U$3.P$3 31.1,10.64 31.1,9.8 31,9.7 30.6,9.7 30.3,9.4 30.3,8.75 29.95,8.4 U$2.2
N$26
  Top 0.5: JP2.P$9 24.47,19.27 24.9,19.7 24.9,22.2 Q1.3
N$27
  Top 0.2: U$1.P$29 U$1.P$30 | U$1.P$28 U$1.P$29 | U$1.P$29 17.54,10.76 17.3,11 16.8,11 16.11,11.69 R6.P$4
N$30
  Top 0.25: C24.P$3 16,18.8 17.1,19.9 17.1,20.85 IC1.4
RST  (via drill 0.3)
  Top 0.2: v28.45,7.2 U$2.5 28.45,11.98 R4.P$3 C22.P$3
  Bottom 0.2: JP3.P$2 31.3,3.7 29.6,5.4 29.6,6.6 29.4,6.8 28.75,6.8 28.45,7.1 v28.45,7.2
RX  (via drill 0.3)
  Top 0.2: 27.5,3 27.6,3.1 v27.6,3.2 27.45,3.05 U$2.24
  Bottom 0.2: v27.6,3.2 27.6,2.4 26.7,1.5 22.5,1.5 20.7,3.3 20.7,10.4 17.5,13.6 9.6,13.6 9.11,14.09 U$6.1
TEST  (via drill 0.3)
  Top 0.2: U$2.37 v30.3,5.85 30.2,5.85
  Bottom 0.2: 30.21,5.74 v30.3,5.85 30.46,5.84 JP3.P$3
TX  (via drill 0.3)
  Top 0.2: 26.9,2.9 v26.6,3.2 26.95,2.85 U$2.23
  Bottom 0.2: v26.6,3.2 26.6,2.2 26.3,1.9 22.7,1.9 21.1,3.5 21.1,10.6 17.7,14 11.2,14 10.61,14.59 U$6.2
VLOAD  (via drill 0.3)
  Top 0.25: R13.P$3 14.8,23.3 15,23.5 v15.8,23.5 | IC1.3 v15.8,23.5 | C17.P$3 v15.8,23.5
  Top 0.5: IC1.1 v20.4,23.5 | Q1.2 21.99,21.31 21.7,21.6 21.7,22.3 21.5,22.5 20.62,22.5 C23.P$1 20.6,23.3 v20.4,23.5 | 20.43,23.5 v20.4,23.5
  Bottom 0.25: v15.8,23.5 v20.4,23.5